# EAGLE design SerialResetBoard (EAGLE 6.4)
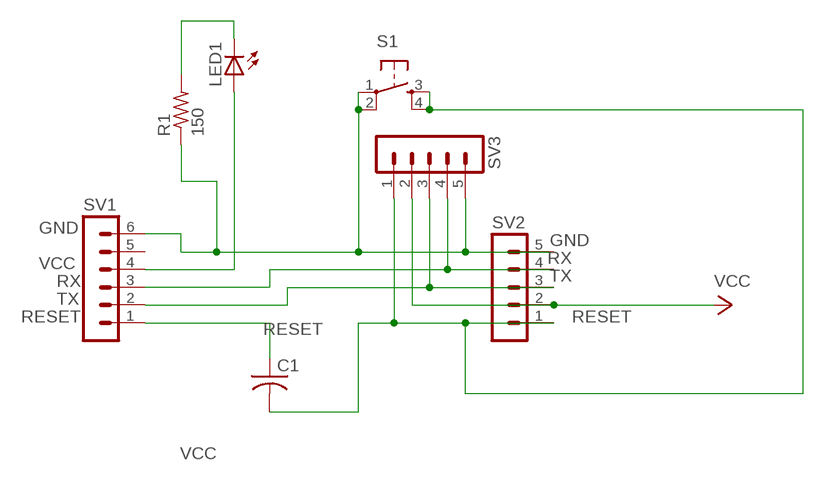
[diagram p0: schematic, sheet 1]

## Parts
C1  C-US025-024X044  [C025-024X044]
LED1  LED3MM  [LED3MM]
R1  150  R-US_0207/7  [0207/7]
S1  TAC_SWITCHPTH  [TACTILE-PTH]
SV1  MA06-1  [MA06-1]
SV2  MA05-1  [MA05-1]
SV3  MA05-1  [MA05-1]

## Nets
GND [vcc]: R1.1 S1.1 S1.2 SV1.6 SV2.5 SV3.5
N$1: LED1.K(C) R1.2
N$2: C1.1 SV1.1
RESET: C1.2 S1.3 S1.4 SV2.1 SV3.1
RX: SV1.3 SV2.4 SV3.4
TX: SV1.2 SV2.3 SV3.3
VCC [vcc]: LED1.A SV1.4 SV2.2 SV3.2
Unconnected: SV1.5

## Library data of the parts
C1 = adafruit:C-US: CAPACITOR, American symbol
LED1 = adafruit:LED: LED OSRAM: - CHIPLED LG R971, LG N971, LY N971, LG Q971, LY Q971, LO R971, LY R971 LH N974, LH R974 LS Q976, LO Q976, LY Q976 LO Q996 - Hyper CHIPLED LW Q18S LB Q993, LB Q99A, LB R99A - SideLED LS A670, LO A670, LY A670, LG A670, LP A670 LB A673, LV A673, LT A673, LW A673 LH A674 LY A675 LS A676, LA A676, LO A676, LY A676, LW A676 LS A679, LY A679, LG A679 - Hyper Micro SIDELED® LS Y876, LA Y876, LO Y876, LY Y876 LT Y87S - SmartLED LW L88C, LW L88S LB L89C, LB L89S, LG L890 LS L89K, LO L89K, LY L89K LS L896, LA L896, LO L896, LY L896 - TOPLED LS T670, LO T670, LY T670, LG T670, LP T670 LSG T670, LSP T670, LSY T670, LOP T670, LYG T670 LG T671, LOG T671, LSG T671 LB T673, LV T673, LT T673, LW T673 LH T674 LS T676, LA T676, LO T676, LY T676, LB T676, LH T676, LSB T676, LW T676 LB T67C, LV T67C, LT T67C, LS T67K, LO T67K, LY T67K, LW E67C LS E67B, LA E67B, LO E67B, LY E67B, LB E67C, LV E67C, LT E67C LW T67C LS T679, LY T679, LG T679 LS T770, LO T770, LY T770, LG T770, LP T770 LB T773, LV T773, LT T773, LW T773 LH T774 LS E675, LA E675, LY E675, LS T675 LS T776, LA T776, LO T776, LY T776, LB T776 LHGB T686 LT T68C, LB T68C - Hyper Mini TOPLED® LB M676 - Mini TOPLED Santana® LG M470 LS M47K, LO M47K, LY M47K Source: http://www.osram.convergy.de/
R1 = adafruit:R-US_: RESISTOR, American symbol
S1 = SparkFun-Electromechanical:TAC_SWITCH: Momentary Switch Button commonly used for reset or general input. Spark Fun Electronics SKU : COM-00097 SMT- SWCH-08247
SV1 = con-lstb:MA06-1: PIN HEADER; OC_FARNELL: unknown; OC_NEWARK: unknown
SV2 SV3 = con-lstb:MA05-1: PIN HEADER; OC_FARNELL: unknown; OC_NEWARK: unknown

## Net classes
0 default: width 0.406 mm
1 vcc: width 0.813 mm

## Board
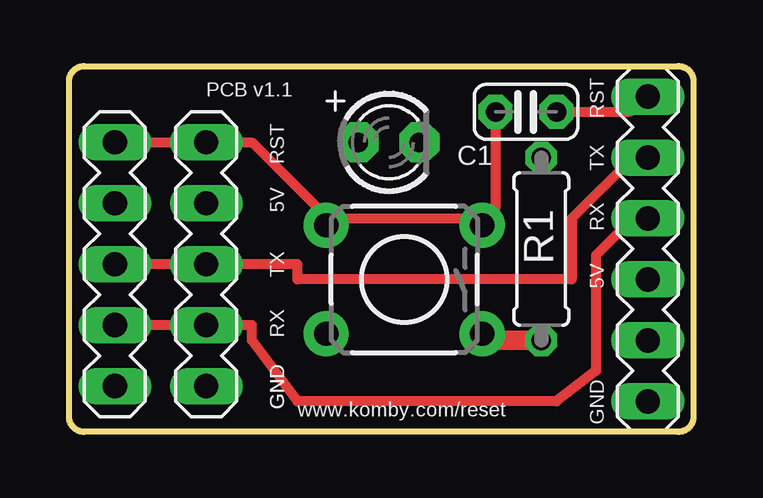
[diagram p1: board, top side]
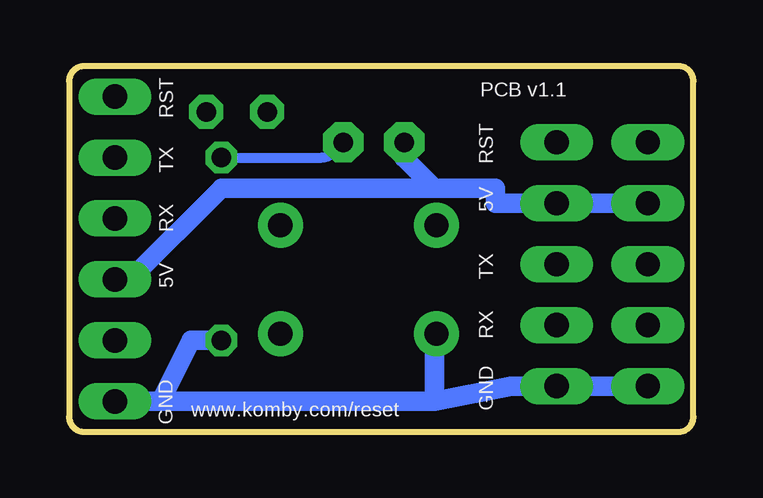
[diagram p2: board, bottom side, seen from below]

Size 26.04 x 15.24 mm. Coordinates in mm from the lower left corner, seen from the top.
Outline: 0.64,15.24 25.4,15.24 arc-90 26.04,14.61 26.04,0.64 arc-90 25.4,0 0.64,0 arc-90 0,0.64 0,14.61 arc-90 0.64,15.24
Copper layers (1*16): Top 0.035mm / dielectric 1.5mm / Bottom 0.035mm
Design rules "Fusion_eagle_rule_v1.1": minimum track width 6mil, minimum drill 12mil, track to track 6mil, track to pad 6mil, pad to pad 6mil, via to via 6mil, smd to smd 0mil, copper to edge 10mil, drill to drill 10mil, minimum pad ring 10mil, minimum via ring 6mil, stop-mask expansion 2mil, vias tented up to drill 100mil, thermal gap 10mil

### Footprints (pad centres in the part's own frame; a part is rotated, then mirrored left to right if it is on the bottom)
C025-024X044 = drill 0.813 pad 1.422 octagon: 1 -1.27,0; 2 1.27,0
LED3MM = drill 0.813 pad 1.676 octagon: A -1.27,0; K 1.27,0
0207/7 = drill 0.813 octagon: 1 -3.81,0; 2 3.81,0
TACTILE-PTH = drill 1.016 pad 1.88: 1 -3.251,2.261; 2 3.251,2.261; 3 -3.251,-2.261; 4 3.251,-2.261
MA06-1 = drill 1.016 long: 1 -6.35,0; 2 -3.81,0; 3 -1.27,0; 4 1.27,0; 5 3.81,0; 6 6.35,0
MA05-1 = drill 1.016 long: 1 -5.08,0; 2 -2.54,0; 3 0,0; 4 2.54,0; 5 5.08,0

### Placement (x,y rotation side)
C1  19.05,13.34 180 top
LED1  13.34,12.06 0 top
R1  19.68,7.62 90 top
S1  13.97,6.35 180 top
SV1  24.13,7.62 270 top
SV2  1.91,6.99 270 top
SV3  5.71,6.99 270 top

### Tracks (layer width: path | path; a pad name or v marks a point on that pad's centre or on a via)
GND
  Top 0.813: R1.1 17.14,3.81 S1.1
  Bottom 0.813: 22.22,1.27 20.95,3.81 R1.1 | 22.22,1.27 SV1.6 | 22.22,1.27 10.79,1.27 | 10.79,1.27 7.62,1.91 SV3.5 SV2.5 | 10.79,1.27 10.79,3.81 S1.2
N$1
  Bottom 0.406: R1.2 15.5,11.43 arc-45 15.05,11.62 LED1.K
N$2
  Top 0.406: C1.1 23.23,13.34 arc45 23.68,13.52 SV1.1
RESET
  Top 0.406: 10.79,8.89 7.62,12.06 SV3.1 SV2.1 | 10.79,8.89 17.14,8.89 S1.3 17.59,8.98 arc45 17.78,9.43 C1.2 | 10.79,8.89 S1.4
RX
  Top 0.406: SV1.3 23.49,8.89 21.97,7.37 21.97,2.54 20.32,1.27 9.53,1.27 7.62,3.81 7.62,4.45 SV3.4 SV2.4
TX
  Top 0.406: SV1.2 23.49,11.43 20.95,8.89 20.95,6.35 9.53,6.35 9.53,6.99 SV3.3 SV2.3
VCC
  Bottom 0.813: 10.79,10.16 12.06,11.43 LED1.A | 10.79,10.16 19.68,10.16 23.49,6.35 SV1.4 | 10.79,10.16 8.26,10.16 8.26,9.53 SV3.2 SV2.2

### Text on the board
tNames: RST | PCB v1.1 | RST | TX | 5V | RX | TX | 5V | RX | GND | GND | www.komby.com/reset
bNames: PCB v1.1 | RST | RST | TX | 5V | RX | TX | 5V | RX | GND | GND | www.komby.com/reset
tSilk: GND